# EAGLE design Bus Definition V1.22 (EAGLE 7.6.0)
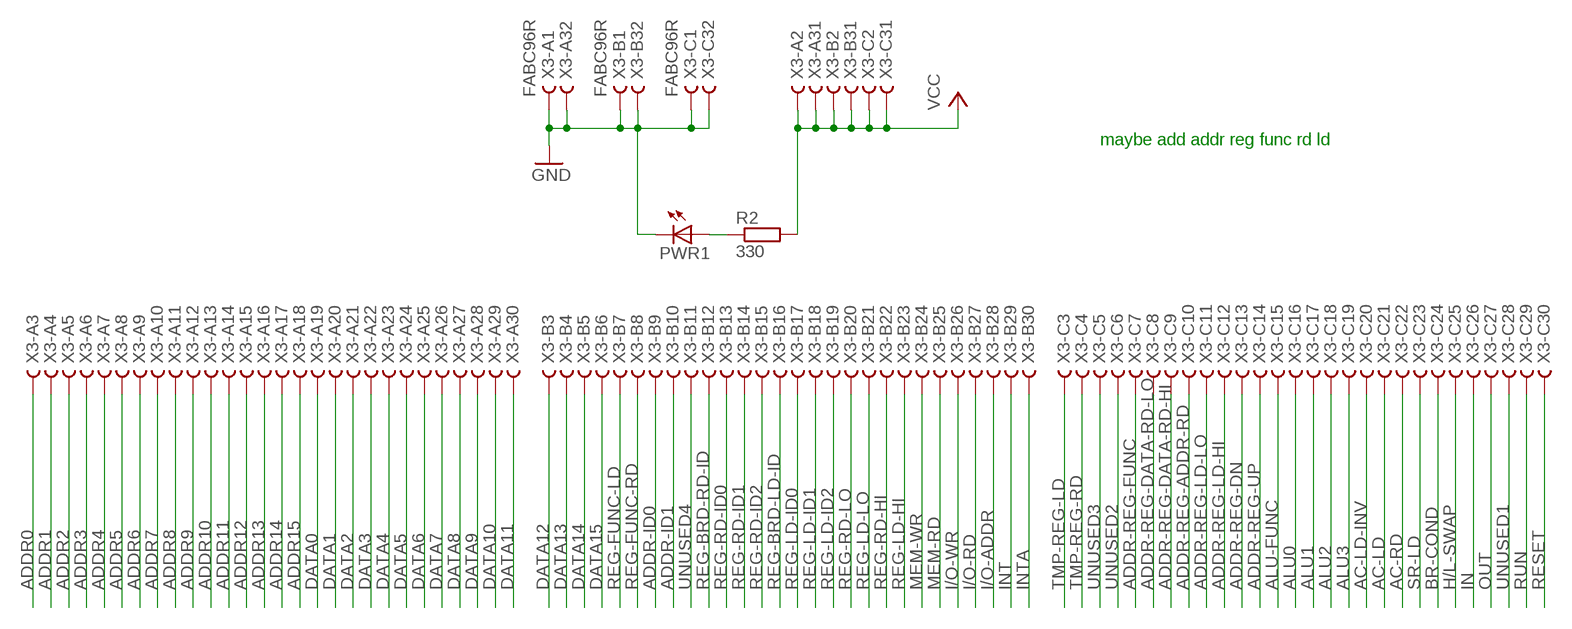
[diagram p0: schematic, sheet 1]

## Parts
PWR1  LED5MM  [LED5MM]
R2  330  R0207/10  [0207/10]
X3  FABC96R  [FABC96R]

## Nets
AC-LD: X3.C21
AC-LD-INV: X3.C20
AC-RD: X3.C22
ADDR0: X3.A3
ADDR1: X3.A4
ADDR2: X3.A5
ADDR3: X3.A6
ADDR4: X3.A7
ADDR5: X3.A8
ADDR6: X3.A9
ADDR7: X3.A10
ADDR8: X3.A11
ADDR9: X3.A12
ADDR10: X3.A13
ADDR11: X3.A14
ADDR12: X3.A15
ADDR13: X3.A16
ADDR14: X3.A17
ADDR15: X3.A18
ADDR-ID0: X3.B9
ADDR-ID1: X3.B10
ADDR-REG-ADDR-RD: X3.C10
ADDR-REG-DATA-RD-HI: X3.C9
ADDR-REG-DATA-RD-LO: X3.C8
ADDR-REG-DN: X3.C13
ADDR-REG-FUNC: X3.C7
ADDR-REG-LD-HI: X3.C12
ADDR-REG-LD-LO: X3.C11
ADDR-REG-UP: X3.C14
ALU0: X3.C16
ALU1: X3.C17
ALU2: X3.C18
ALU3: X3.C19
ALU-FUNC: X3.C15
BR-COND: X3.C24
DATA0: X3.A19
DATA1: X3.A20
DATA2: X3.A21
DATA3: X3.A22
DATA4: X3.A23
DATA5: X3.A24
DATA6: X3.A25
DATA7: X3.A26
DATA8: X3.A27
DATA9: X3.A28
DATA10: X3.A29
DATA11: X3.A30
DATA12: X3.B3
DATA13: X3.B4
DATA14: X3.B5
DATA15: X3.B6
GND: PWR1.K(C) X3.A1 X3.A32 X3.B1 X3.B32 X3.C1 X3.C32
H/L-SWAP: X3.C25
I/O-ADDR: X3.B28
I/O-RD: X3.B27
I/O-WR: X3.B26
IN: X3.C26
INT: X3.B29
INTA: X3.B30
MEM-RD: X3.B25
MEM-WR: X3.B24
N$30: PWR1.A R2.1
OUT: X3.C27
REG-BRD-LD-ID: X3.B16
REG-BRD-RD-ID: X3.B12
REG-FUNC-LD: X3.B7
REG-FUNC-RD: X3.B8
REG-LD-HI: X3.B23
REG-LD-ID0: X3.B17
REG-LD-ID1: X3.B18
REG-LD-ID2: X3.B19
REG-LD-LO: X3.B21
REG-RD-HI: X3.B22
REG-RD-ID0: X3.B13
REG-RD-ID1: X3.B14
REG-RD-ID2: X3.B15
REG-RD-LO: X3.B20
RESET: X3.C30
RUN: X3.C29
SR-LD: X3.C23
TMP-REG-LD: X3.C3
TMP-REG-RD: X3.C4
UNUSED1: X3.C28
UNUSED2: X3.C6
UNUSED3: X3.C5
UNUSED4: X3.B11
VCC: R2.2 X3.A2 X3.A31 X3.B2 X3.B31 X3.C2 X3.C31

## Notes on the sheet
- maybe add addr reg func rd ld

## Library data of the parts
PWR1 = led:LED: LED OSRAM: - CHIPLED LG R971, LG N971, LY N971, LG Q971, LY Q971, LO R971, LY R971 LH N974, LH R974 LS Q976, LO Q976, LY Q976 LO Q996 - Hyper CHIPLED LW Q18S LB Q993, LB Q99A, LB R99A - SideLED LS A670, LO A670, LY A670, LG A670, LP A670 LB A673, LV A673, LT A673, LW A673 LH A674 LY A675 LS A676, LA A676, LO A676, LY A676, LW A676 LS A679, LY A679, LG A679 - Hyper Micro SIDELED® LS Y876, LA Y876, LO Y876, LY Y876 LT Y87S - SmartLED LW L88C, LW L88S LB L89C, LB L89S, LG L890 LS L89K, LO L89K, LY L89K LS L896, LA L896, LO L896, LY L896 - TOPLED LS T670, LO T670, LY T670, LG T670, LP T670 LSG T670, LSP T670, LSY T670, LOP T670, LYG T670 LG T671, LOG T671, LSG T671 LB T673, LV T673, LT T673, LW T673 LH T674 LS T676, LA T676, LO T676, LY T676, LB T676, LH T676, LSB T676, LW T676 LB T67C, LV T67C, LT T67C, LS T67K, LO T67K, LY T67K, LW E67C LS E67B, LA E67B, LO E67B, LY E67B, LB E67C, LV E67C, LT E67C LW T67C LS T679, LY T679, LG T679 LS T770, LO T770, LY T770, LG T770, LP T770 LB T773, LV T773, LT T773, LW T773 LH T774 LS E675, LA E675, LY E675, LS T675 LS T776, LA T776, LO T776, LY T776, LB T776 LHGB T686 LT T68C, LB T68C - Hyper Mini TOPLED® LB M676 - Mini TOPLED Santana® LG M470 LS M47K, LO M47K, LY M47K Source: http://www.osram.convergy.de LUXEON: - LUMILED® LXK2-PW12-R00, LXK2-PW12-S00, LXK2-PW14-U00, LXK2-PW14-V00 LXK2-PM12-R00, LXK2-PM12-S00, LXK2-PM14-U00 LXK2-PE12-Q00, LXK2-PE12-R00, LXK2-PE12-S00, LXK2-PE14-T00, LXK2-PE14-U00 LXK2-PB12-K00, LXK2-PB12-L00, LXK2-PB12-M00, LXK2-PB14-N00, LXK2-PB14-P00, LXK2-PB14-Q00 LXK2-PR12-L00, LXK2-PR12-M00, LXK2-PR14-Q00, LXK2-PR14-R00 LXK2-PD12-Q00, LXK2-PD12-R00, LXK2-PD12-S00 LXK2-PH12-R00, LXK2-PH12-S00 LXK2-PL12-P00, LXK2-PL12-Q00, LXK2-PL12-R00 Source: www.luxeon.com KINGBRIGHT: KA-3528ASYC Source: www.kingbright.com
R2 = eagle-ltspice:R: RESISTOR, European symbol; SPICEMODEL: NONE; SPICEPREFIX: R
X3 = con-vg:FABC96R: CONNECTOR female, 96 pins, type R, rows ABC, grid 2.54 mm

## Board
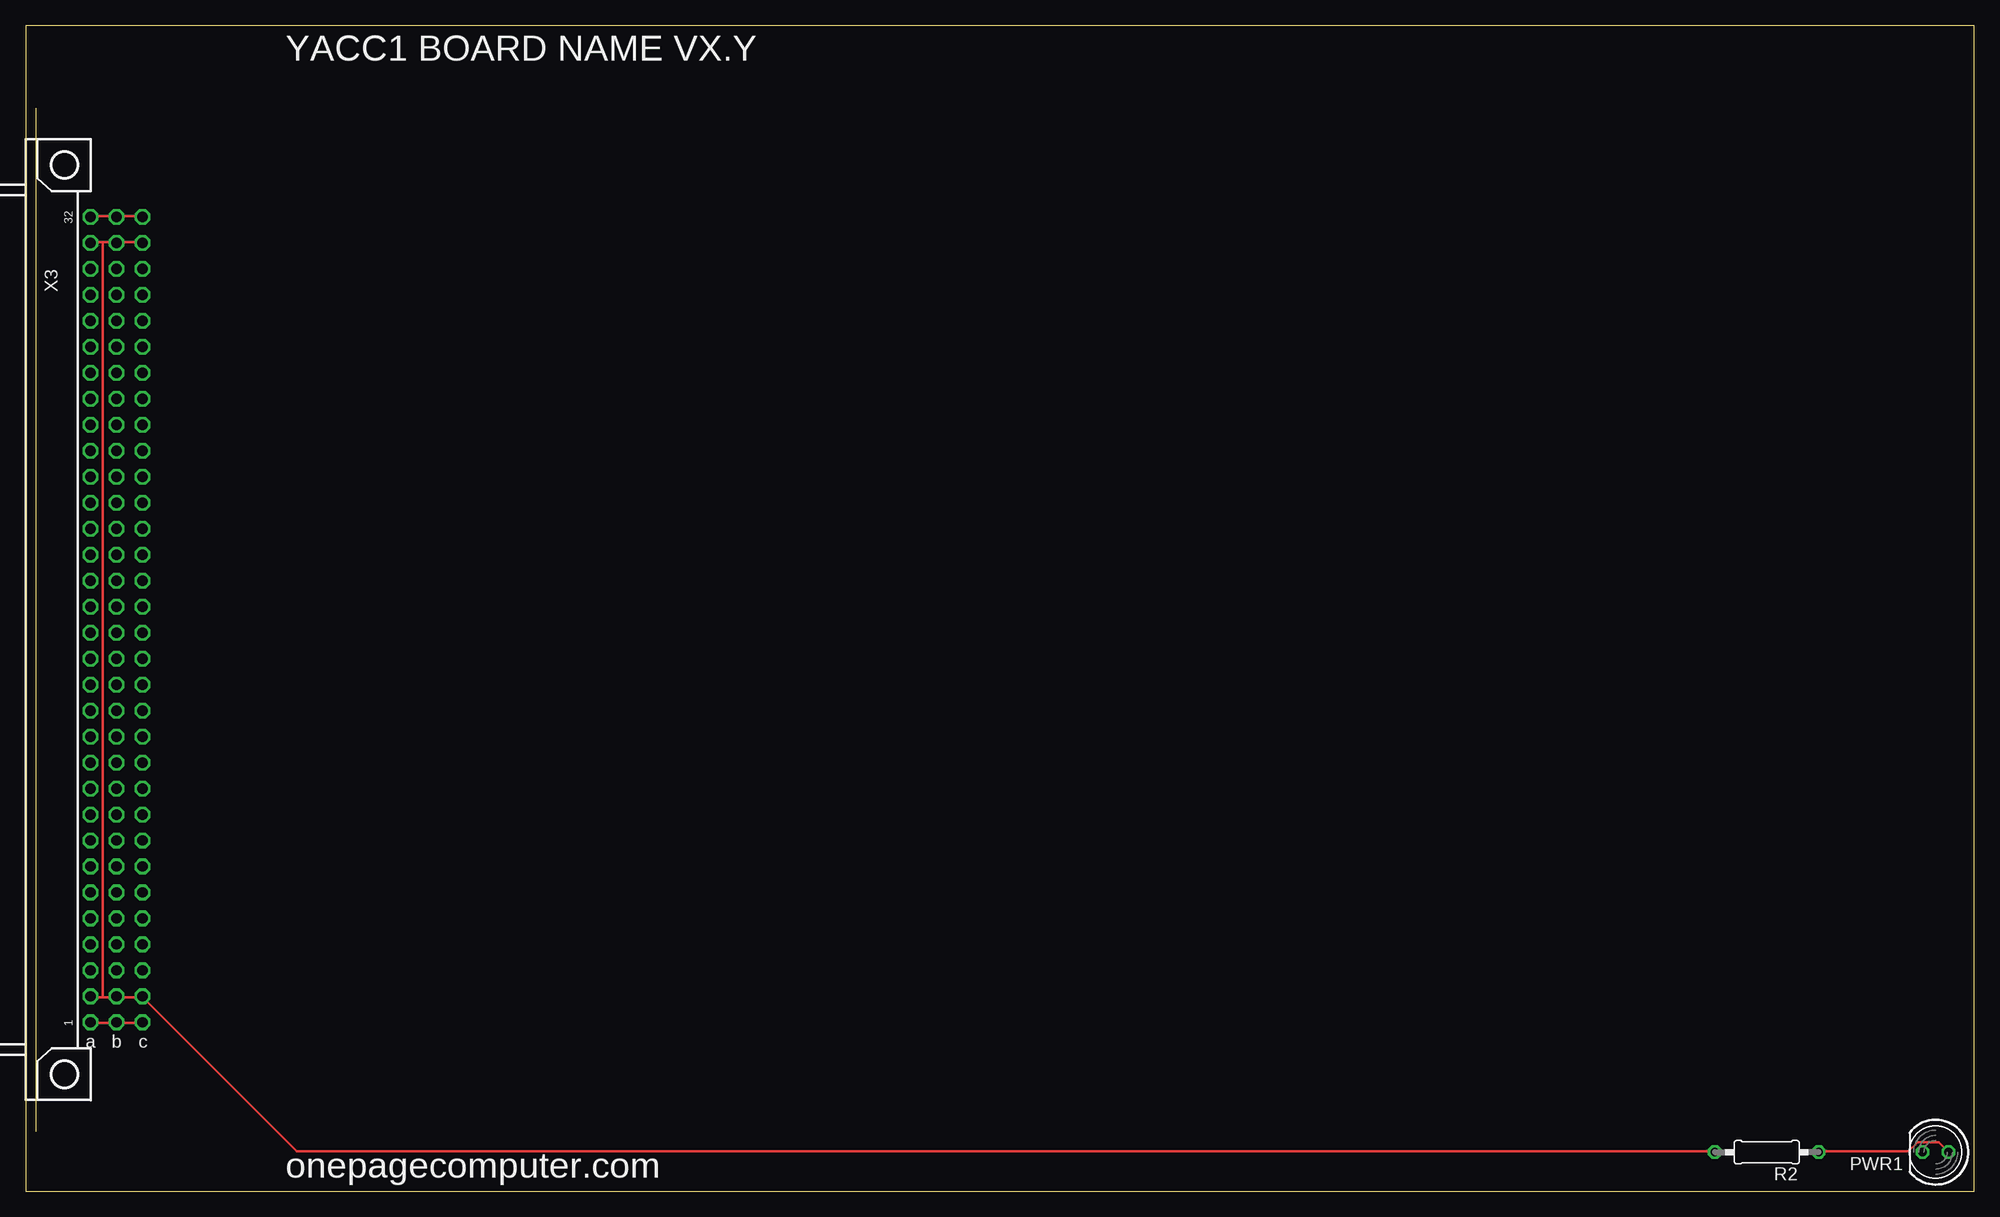
[diagram p1: board, top side]
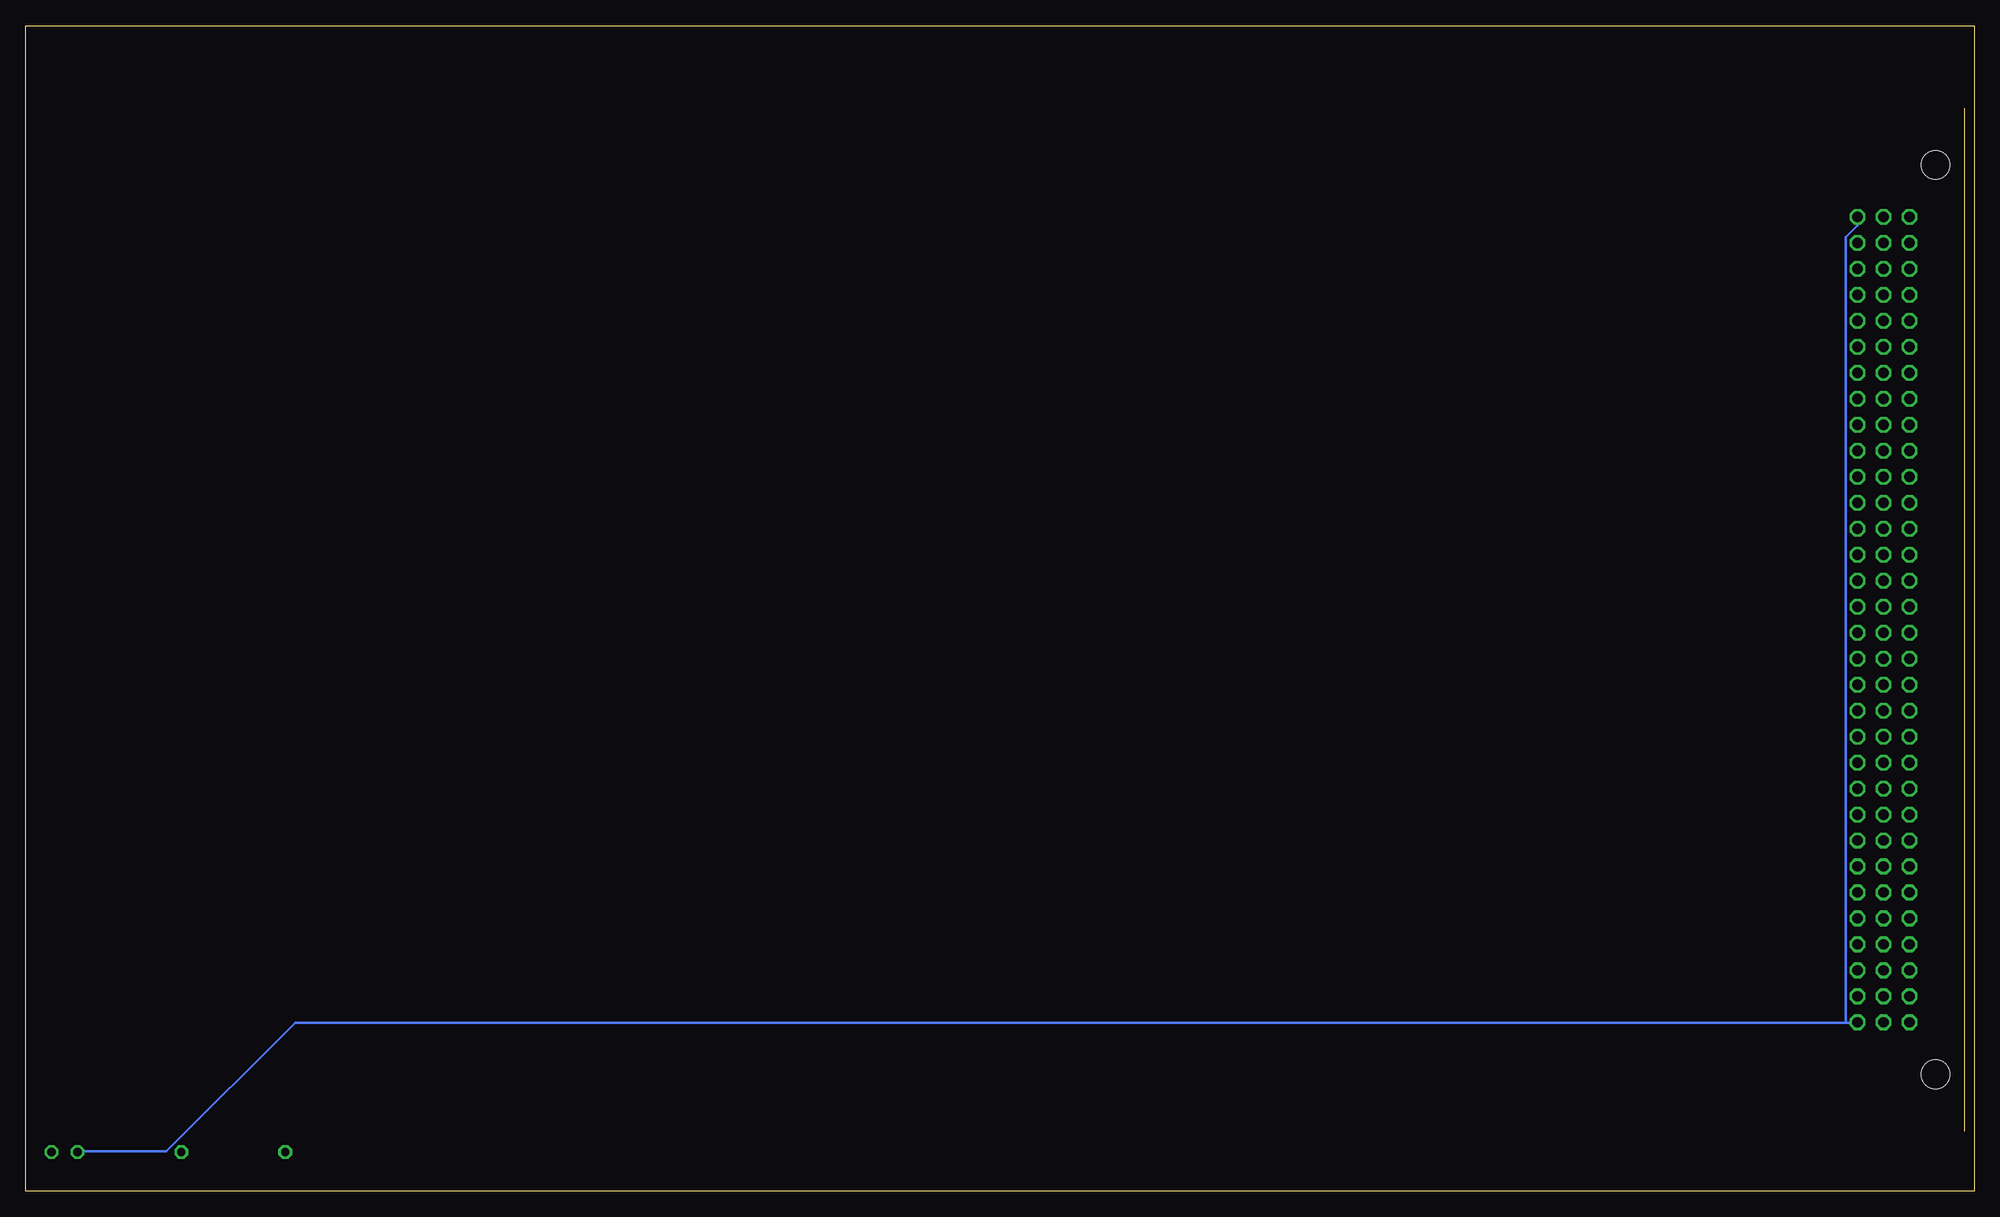
[diagram p2: board, bottom side, seen from below]

Size 190.48 x 113.97 mm. Coordinates in mm from the lower left corner, seen from the top.
Outline: 0,0 190.48,0 190.48,113.97 0,113.97 0,0
Copper layers (1*16): Top 0.035mm / dielectric 1.5mm / Bottom 0.035mm
Design rules "default": minimum track width 10mil, minimum drill 24mil, track to track 8mil, track to pad 8mil, pad to pad 8mil, via to via 8mil, smd to smd 8mil, copper to edge 40mil, drill to drill 8mil, minimum pad ring 10mil, minimum via ring 8mil, stop-mask expansion 4mil, vias tented up to drill 0mil, thermal gap 10mil

### Footprints (pad centres in the part's own frame; a part is rotated, then mirrored left to right if it is on the bottom)
LED5MM = drill 0.813 octagon: A -1.27,0; K 1.27,0
0207/10 = drill 0.813 octagon: 1 -5.08,0; 2 5.08,0
FABC96R = drill 1.016 octagon: A1 -2.54,39.37; A2 -2.54,36.83; A3 -2.54,34.29; A4 -2.54,31.75; A5 -2.54,29.21; A6 -2.54,26.67; A7 -2.54,24.13; A8 -2.54,21.59; A9 -2.54,19.05; A10 -2.54,16.51; A11 -2.54,13.97; A12 -2.54,11.43; A13 -2.54,8.89; A14 -2.54,6.35; A15 -2.54,3.81; A16 -2.54,1.27; A17 -2.54,-1.27; A18 -2.54,-3.81; A19 -2.54,-6.35; A20 -2.54,-8.89; A21 -2.54,-11.43; A22 -2.54,-13.97; A23 -2.54,-16.51; A24 -2.54,-19.05; A25 -2.54,-21.59; A26 -2.54,-24.13; A27 -2.54,-26.67; A28 -2.54,-29.21; A29 -2.54,-31.75; A30 -2.54,-34.29; A31 -2.54,-36.83; A32 -2.54,-39.37; B1 -5.08,39.37; B2 -5.08,36.83; B3 -5.08,34.29; B4 -5.08,31.75; B5 -5.08,29.21; B6 -5.08,26.67; B7 -5.08,24.13; B8 -5.08,21.59; B9 -5.08,19.05; B10 -5.08,16.51; B11 -5.08,13.97; B12 -5.08,11.43; B13 -5.08,8.89; B14 -5.08,6.35; B15 -5.08,3.81; B16 -5.08,1.27; B17 -5.08,-1.27; B18 -5.08,-3.81; B19 -5.08,-6.35; B20 -5.08,-8.89; B21 -5.08,-11.43; B22 -5.08,-13.97; B23 -5.08,-16.51; B24 -5.08,-19.05; B25 -5.08,-21.59; B26 -5.08,-24.13; B27 -5.08,-26.67; B28 -5.08,-29.21; B29 -5.08,-31.75; B30 -5.08,-34.29; B31 -5.08,-36.83; B32 -5.08,-39.37; C1 -7.62,39.37; C2 -7.62,36.83; C3 -7.62,34.29; C4 -7.62,31.75; C5 -7.62,29.21; C6 -7.62,26.67; C7 -7.62,24.13; C8 -7.62,21.59; C9 -7.62,19.05; C10 -7.62,16.51; C11 -7.62,13.97; C12 -7.62,11.43; C13 -7.62,8.89; C14 -7.62,6.35; C15 -7.62,3.81; C16 -7.62,1.27; C17 -7.62,-1.27; C18 -7.62,-3.81; C19 -7.62,-6.35; C20 -7.62,-8.89; C21 -7.62,-11.43; C22 -7.62,-13.97; C23 -7.62,-16.51; C24 -7.62,-19.05; C25 -7.62,-21.59; C26 -7.62,-24.13; C27 -7.62,-26.67; C28 -7.62,-29.21; C29 -7.62,-31.75; C30 -7.62,-34.29; C31 -7.62,-36.83; C32 -7.62,-39.37 | hole 2.794: 0,-44.456; 0,44.456

### Placement (x,y rotation side)
PWR1  186.69,3.81 180 top
R2  170.18,3.81 180 top
X3  3.81,55.88 180 top

### Tracks (layer width: path | path; a pad name or v marks a point on that pad's centre or on a via)
GND
  Top 0.254: X3.A32 6.4,95.33 8.69,95.33 X3.B32 8.91,95.33 11.43,95.33 X3.C32 | X3.A1 6.4,16.46 8.69,16.46 X3.B1 8.91,16.46 11.43,16.46 X3.C1
  Bottom 0.254: 12.57,16.46 11.43,16.46 X3.C1 | 12.57,16.46 164.13,16.46 176.71,3.89 185.4,3.89 PWR1.K | X3.C32 11.43,94.41 12.57,93.27 12.57,16.46
N$30
  Top 0.254: R2.1 175.34,3.89 184.02,3.89 184.94,4.8 187,4.8 187.91,3.89 PWR1.A
VCC
  Top 0.254: 7.54,92.81 8.69,92.81 X3.B31 8.91,92.81 11.43,92.81 X3.C31 | 7.54,92.81 6.4,92.81 X3.A31 | 7.54,18.97 8.69,18.97 X3.B2 8.91,18.97 11.43,18.97 | 7.54,18.97 6.4,18.97 X3.A2 | 11.43,18.97 26.52,3.89 165.05,3.89 R2.2 | 11.43,18.97 X3.C2 | 7.54,18.97 7.54,92.81

### Text on the board
tNames: YACC1 BOARD NAME VX.Y | onepagecomputer.com